# EAGLE schematic SisMinLF (EAGLE 9.0.1)
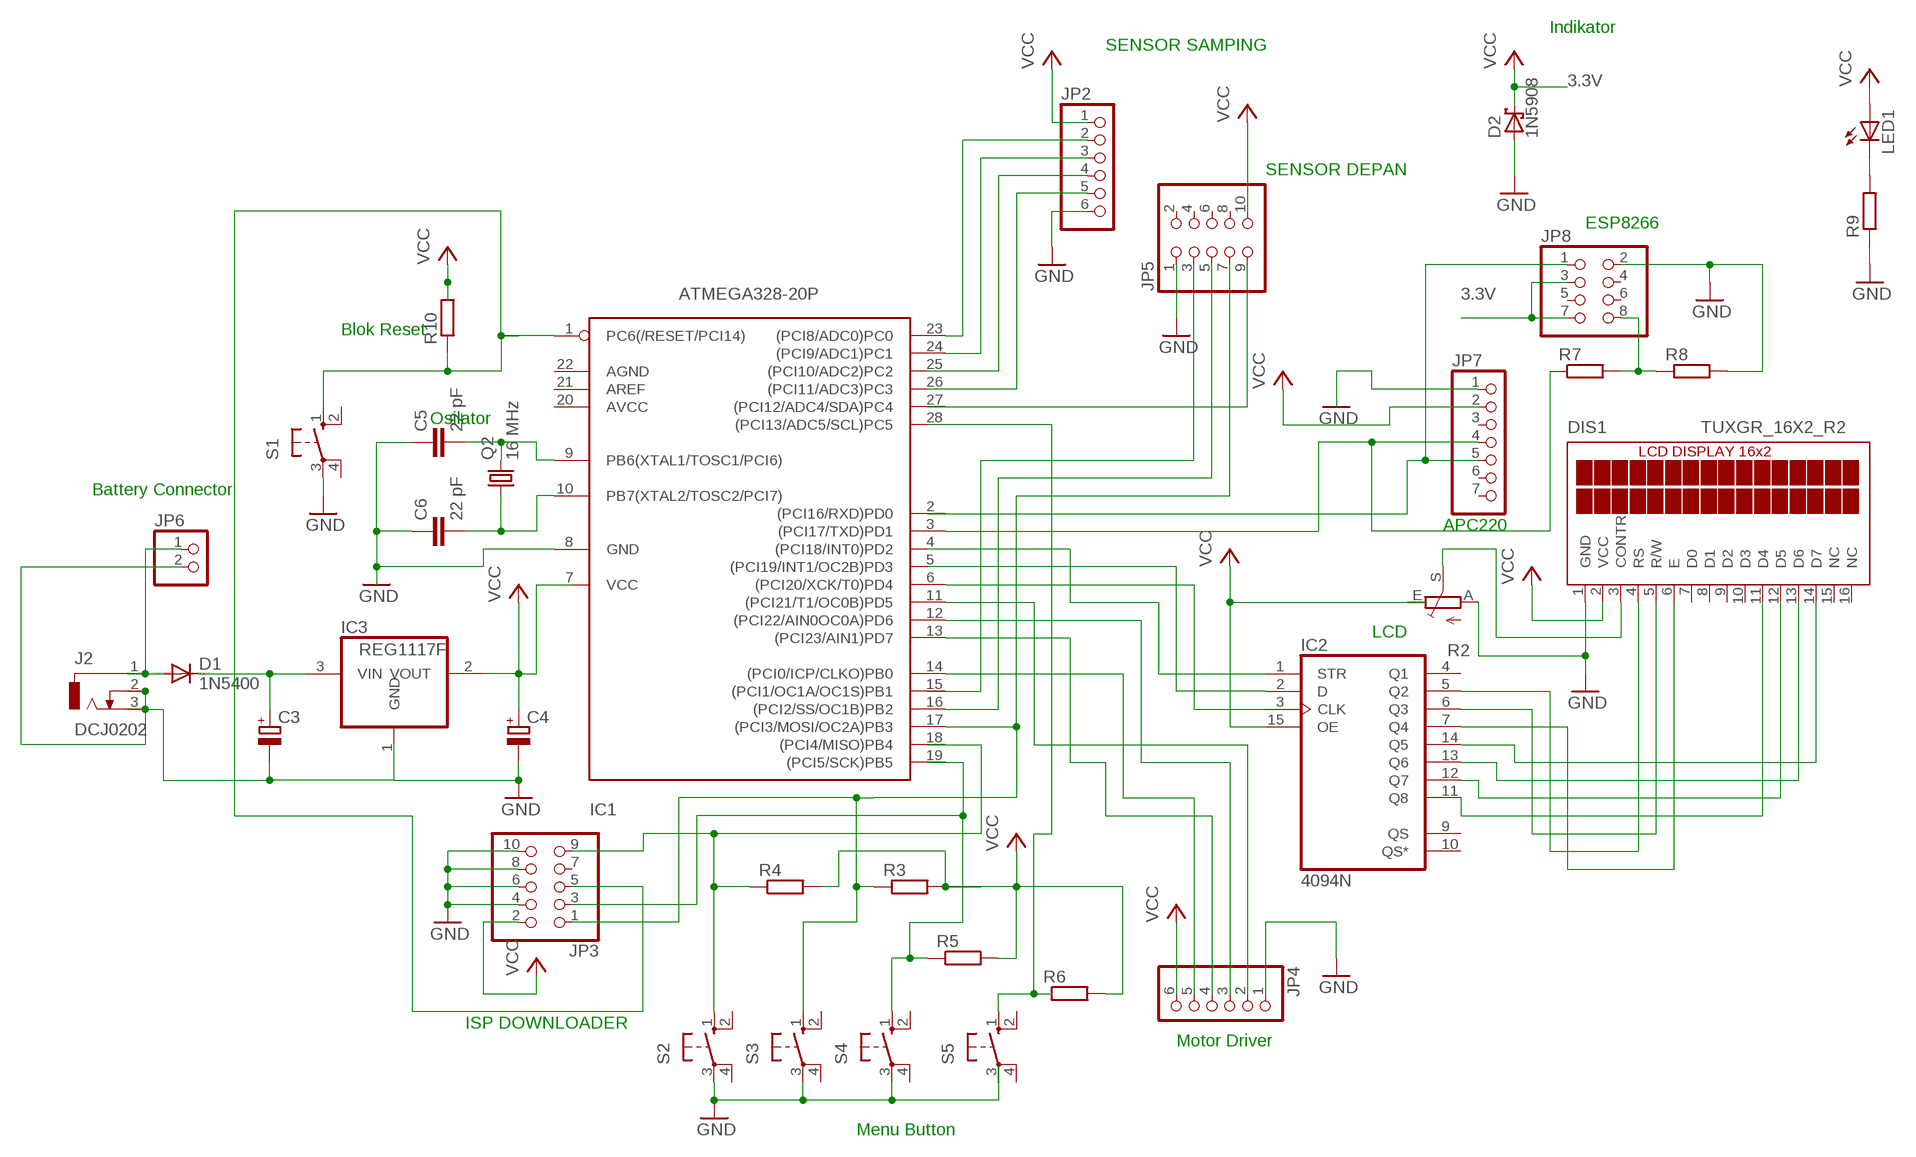
[diagram p0: schematic, sheet 1]

## Parts
C3  CPOL-EUE2.5-6  [E2,5-6]
C4  CPOL-EUE2.5-6  [E2,5-6]
C5  22 pF  C-EU025-024X044  [C025-024X044]
C6  22 pF  C-EU025-024X044  [C025-024X044]
D1  1N5400  [DO201-15]
D2  1N5908  [C4111-15]
DIS1  TUXGR_16X2_R2  [TUXGR_16X2_R2]
IC1  ATMEGA328-20P  [DIL28-3]
IC2  4094N  [DIL16]
IC3  REG1117F  [DD-3]
J2  DCJ0202  [DCJ0202]
JP2  PINHD-1X6  [1X06]
JP3  PINHD-2X5  [2X05]
JP4  PINHD-1X6  [1X06]
JP5  PINHD-2X5  [2X05]
JP6  PINHD-1X2  [1X02]
JP7  PINHD-1X7  [1X07]
JP8  PINHD-2X4  [2X04]
LED1  LED5MM  [LED5MM]
Q2  16 MHz  CRYSTALHC18U-V  [HC18U-V]
R2  TRIM_EU-B25P  [B25P]
R3  R-EU_0204/7  [0204/7]
R4  R-EU_0204/7  [0204/7]
R5  R-EU_0204/7  [0204/7]
R6  R-EU_0204/7  [0204/7]
R7  R-EU_0204/7  [0204/7]
R8  R-EU_0204/7  [0204/7]
R9  R-EU_0204/7  [0204/7]
R10  R-EU_0204/7  [0204/7]
S1  10-XX  [B3F-10XX]
S2  10-XX  [B3F-10XX]
S3  10-XX  [B3F-10XX]
S4  10-XX  [B3F-10XX]
S5  10-XX  [B3F-10XX]

## Nets
3.3V: JP8.3 JP8.7
GND: C3.- C4.- C5.1 C6.1 D2.A DIS1.1(GND) IC1.8(GND) J2.2 J2.3 JP2.6 JP3.4 JP3.6 JP3.8 JP3.10 JP4.1 JP5.1 JP6.2 JP8.2 R2.A R8.2 R9.1 S1.3(P)
N$1: C5.2 IC1.9(PB6(XTAL1/TOSC1/PCI6)) Q2.2
N$2: C6.2 IC1.10(PB7(XTAL2/TOSC2/PCI7)) Q2.1
N$3: JP3.5
N$4: JP7.5 JP8.1
N$5: IC1.12((PCI22/AIN0OC0A)PD6) JP4.3
N$6: IC2.2(D)
N$7: IC1.6((PCI20/XCK/T0)PD4) IC2.3(CLK)
N$8: IC1.3((PCI17/TXD)PD1) JP7.4 R7.1
N$9: IC1.14((PCI0/ICP/CLKO)PB0) JP4.5
N$10: IC1.13((PCI23/AIN1)PD7) JP4.4
N$11: JP5.3
N$12: D1.A J2.1 JP6.1
N$13: JP7.1
N$14: IC1.16((PCI2/SS/OC1B)PB2) JP5.5
N$15: JP5.9
N$16: IC1.23((PCI8/ADC0)PC0) JP2.2
N$18: IC1.11((PCI21/T1/OC0B)PD5) JP4.2
N$19: IC1.17((PCI3/MOSI/OC2A)PB3) JP3.1 JP5.7 R3.1 S3.1(S)
N$20: JP3.9 R4.1 S2.1(S)
N$21: LED1.K(C) R9.2
N$22: R6.1 S5.1(S)
N$23: IC1.24((PCI9/ADC1)PC1) JP2.3
N$24: JP2.4
N$25: DIS1.3(CONTR) R2.S
N$26: IC2.1(STR)
N$27: JP2.5
N$30: IC1.1(PC6(/RESET/PCI14)) R10.1 S1.1(S)
N$32: S2.3(P) S3.3(P) S4.3(P) ; supply symbol labelled GND
N$33: JP3.3 R5.1 S4.1(S)
N$35: JP8.8 R7.2 R8.1
N$37: DIS1.5(R/W) IC2.6(Q3)
N$38: DIS1.14(D7) IC2.14(Q5)
N$39: DIS1.13(D6) IC2.13(Q6)
N$40: DIS1.12(D5) IC2.12(Q7)
N$41: DIS1.11(D4) IC2.11(Q8)
N$42: DIS1.4(RS) IC2.5(Q2)
N$43: DIS1.6(E) IC2.7(Q4)
N$46: C3.+ D1.C IC3.3(VIN)
VCC: C4.+ D2.C DIS1.2(VCC) IC2.15(OE) IC3.2(VOUT) JP2.1 JP3.2 JP4.6 JP5.10 JP7.2 LED1.A R2.E R3.2 R4.2 R5.2 R6.2 R10.2
Unconnected: DIS1.7(D0) DIS1.8(D1) DIS1.9(D2) DIS1.10(D3) DIS1.15(NC) DIS1.16(NC) IC1.2((PCI16/RXD)PD0) IC1.4((PCI18/INT0)PD2) IC1.5((PCI19/INT1/OC2B)PD3) IC1.7(VCC) IC1.15((PCI1/OC1A/OC1S)PB1) IC1.18((PCI4/MISO)PB4) IC1.19((PCI5/SCK)PB5) IC1.20(AVCC) IC1.21(AREF) IC1.22(AGND) IC1.25((PCI10/ADC2)PC2) IC1.26((PCI11/ADC3)PC3) IC1.27((PCI12/ADC4/SDA)PC4) IC1.28((PCI13/ADC5/SCL)PC5) IC2.4(Q1) IC2.9(QS) IC2.10(QS*) JP3.7 JP5.2 JP5.4 JP5.6 JP5.8 JP7.3 JP7.6 JP7.7 JP8.4 JP8.5 JP8.6 S1.2(S1) S1.4(P1) S2.2(S1) S2.4(P1) S3.2(S1) S3.4(P1) S4.2(S1) S4.4(P1) S5.2(S1) S5.3(P) S5.4(P1)

## Notes on the sheet
- Indikator
- SENSOR SAMPING
- SENSOR DEPAN
- ESP8266
- Blok Reset
- Osilator
- Battery Connector
- APC220
- LCD
- ISP DOWNLOADER
- Motor Driver
- Menu Button

## Power pins joined to a net without a drawn wire
GND: IC3.1(GND)
VDD: IC2.16(VDD)
VSS: IC2.8(VSS)

## Library data of the parts
C3 C4 = rcl:CPOL-EU: POLARIZED CAPACITOR, European symbol
C5 C6 = rcl:C-EU: CAPACITOR, European symbol
D1 = diode:1N5400: DIODE standard rectifier, 3 A, 50 V (Motorola)
D2 = diode:1N5908: DIODE schottky
DIS1 = display-lcd:TUXGR_16X2_R2: Tuxgraphics LCD display 16x2 characters reflective, without background light Source: tuxgr_12x2_r2.pdf; OC_FARNELL: unknown; OC_NEWARK: unknown
IC1 = atmega328:ATMEGA328*P: MICROCONTROLLER 32 kBytes FLASH 2 kBytes SRAM 1 kBytes EEPROM USART 8-channel 10 bit ADC
IC2 = 40xx:4094: 8-stage SHIFT/STORE REGISTER, tri-state
IC3 = burr-brown:REG1117: 800mA and 1A Low Dropout (LDO) Positive Regulator 1.8V, 2.5V, 2.85V, 3.3V, 5V, and Adj; MF: TEXAS INSTRUMENTS; MPN: REG1117FAKTTT; OC_FARNELL: 1296120; OC_NEWARK: 87H2562
J2 = con-jack:DCJ0202: DC POWER JACK Source: DCJ0202.pdf; OC_FARNELL: unknown; OC_NEWARK: unknown
JP2 JP4 = pinhead:PINHD-1X6: PIN HEADER
JP3 JP5 = pinhead:PINHD-2X5: PIN HEADER
JP6 = pinhead:PINHD-1X2: PIN HEADER
JP7 = pinhead:PINHD-1X7: PIN HEADER
JP8 = pinhead:PINHD-2X4: PIN HEADER
LED1 = led:LED: LED OSRAM: - CHIPLED LG R971, LG N971, LY N971, LG Q971, LY Q971, LO R971, LY R971 LH N974, LH R974 LS Q976, LO Q976, LY Q976 LO Q996 - Hyper CHIPLED LW Q18S LB Q993, LB Q99A, LB R99A - SideLED LS A670, LO A670, LY A670, LG A670, LP A670 LB A673, LV A673, LT A673, LW A673 LH A674 LY A675 LS A676, LA A676, LO A676, LY A676, LW A676 LS A679, LY A679, LG A679 - Hyper Micro SIDELED® LS Y876, LA Y876, LO Y876, LY Y876 LT Y87S - SmartLED LW L88C, LW L88S LB L89C, LB L89S, LG L890 LS L89K, LO L89K, LY L89K LS L896, LA L896, LO L896, LY L896 - TOPLED LS T670, LO T670, LY T670, LG T670, LP T670 LSG T670, LSP T670, LSY T670, LOP T670, LYG T670 LG T671, LOG T671, LSG T671 LB T673, LV T673, LT T673, LW T673 LH T674 LS T676, LA T676, LO T676, LY T676, LB T676, LH T676, LSB T676, LW T676 LB T67C, LV T67C, LT T67C, LS T67K, LO T67K, LY T67K, LW E67C LS E67B, LA E67B, LO E67B, LY E67B, LB E67C, LV E67C, LT E67C LW T67C LS T679, LY T679, LG T679 LS T770, LO T770, LY T770, LG T770, LP T770 LB T773, LV T773, LT T773, LW T773 LH T774 LS E675, LA E675, LY E675, LS T675 LS T776, LA T776, LO T776, LY T776, LB T776 LHGB T686 LT T68C, LB T68C - Hyper Mini TOPLED® LB M676 - Mini TOPLED Santana® LG M470 LS M47K, LO M47K, LY M47K Source: http://www.osram.convergy.de LUXEON: - LUMILED® LXK2-PW12-R00, LXK2-PW12-S00, LXK2-PW14-U00, LXK2-PW14-V00 LXK2-PM12-R00, LXK2-PM12-S00, LXK2-PM14-U00 LXK2-PE12-Q00, LXK2-PE12-R00, LXK2-PE12-S00, LXK2-PE14-T00, LXK2-PE14-U00 LXK2-PB12-K00, LXK2-PB12-L00, LXK2-PB12-M00, LXK2-PB14-N00, LXK2-PB14-P00, LXK2-PB14-Q00 LXK2-PR12-L00, LXK2-PR12-M00, LXK2-PR14-Q00, LXK2-PR14-R00 LXK2-PD12-Q00, LXK2-PD12-R00, LXK2-PD12-S00 LXK2-PH12-R00, LXK2-PH12-S00 LXK2-PL12-P00, LXK2-PL12-Q00, LXK2-PL12-R00 Source: www.luxeon.com KINGBRIGHT: KA-3528ASYC Source: www.kingbright.com
Q2 = crystal:CRYSTAL: CRYSTAL; OC_FARNELL: unknown; OC_NEWARK: unknown
R2 = pot:TRIM_EU-: POTENTIOMETER
R3-R10 = resistor:R-EU_: RESISTOR, European symbol
S1-S5 = switch-omron:10-XX: OMRON SWITCH; MPN: B3F-1000; OC_FARNELL: 176432; OC_NEWARK: 36M3542